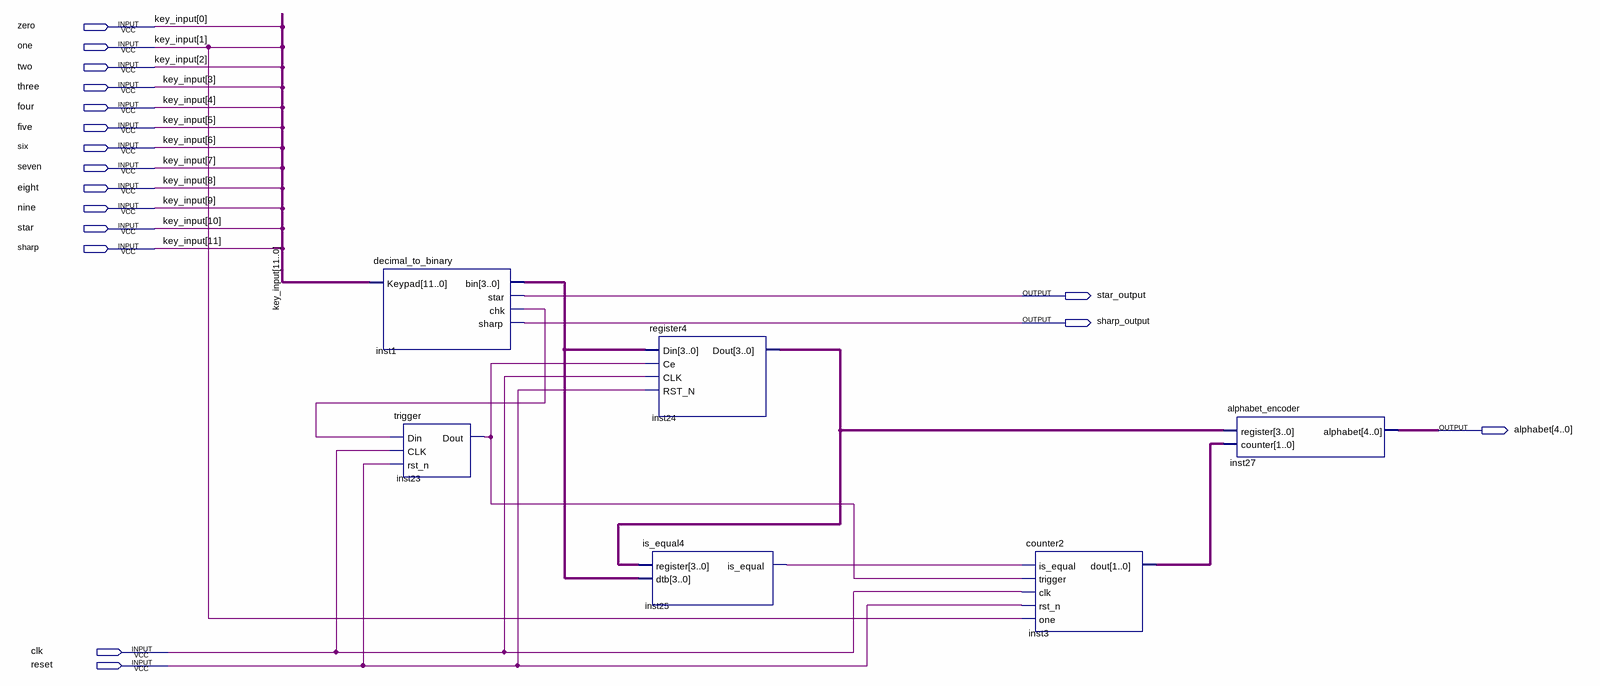
[diagram p0: schematic sheet]
// Quartus schematic keypad_converter.bdf as structural Verilog: 6 symbols, 17 pins
module keypad_converter (
  input  zero,
  input  one,
  input  two,
  input  three,
  input  four,
  input  five,
  input  six,
  input  seven,
  input  eight,
  input  nine,
  input  star,
  input  sharp,
  input  clk,
  input  reset,
  output star_output,
  output sharp_output,
  output [4:0] alphabet
);

  wire inst1_chk, inst23_dout, inst25_is_equal;
  wire [1:0] inst3_dout;
  wire [3:0] inst1_bin, inst24_dout;

  decimal_to_binary inst1 (
    .Keypad({sharp, star, nine, eight, seven, six, five, four, three, two, one, zero}), .bin(inst1_bin),
    .star(star_output), .chk(inst1_chk), .sharp(sharp_output));
  trigger inst23 (.Din(inst1_chk), .CLK(clk), .rst_n(reset), .Dout(inst23_dout));
  register4 inst24 (.Din(inst1_bin), .Ce(inst23_dout), .CLK(clk), .RST_N(reset), .Dout(inst24_dout));
  is_equal4 inst25 (.register(inst24_dout), .dtb(inst1_bin), .is_equal(inst25_is_equal));
  counter2 inst3 (
    .is_equal(inst25_is_equal), .trigger(inst23_dout), .clk(clk), .rst_n(reset), .one(one), .dout(inst3_dout));
  alphabet_encoder inst27 (.register(inst24_dout), .counter(inst3_dout), .alphabet(alphabet));

  // Other names for the same wires on the sheet: key_input[11:0] = {sharp, star, nine, eight, seven, six, five, four, three, two, one, zero}
endmodule
